# EAGLE design USB-RS232 Adapter (EAGLE 4.16)
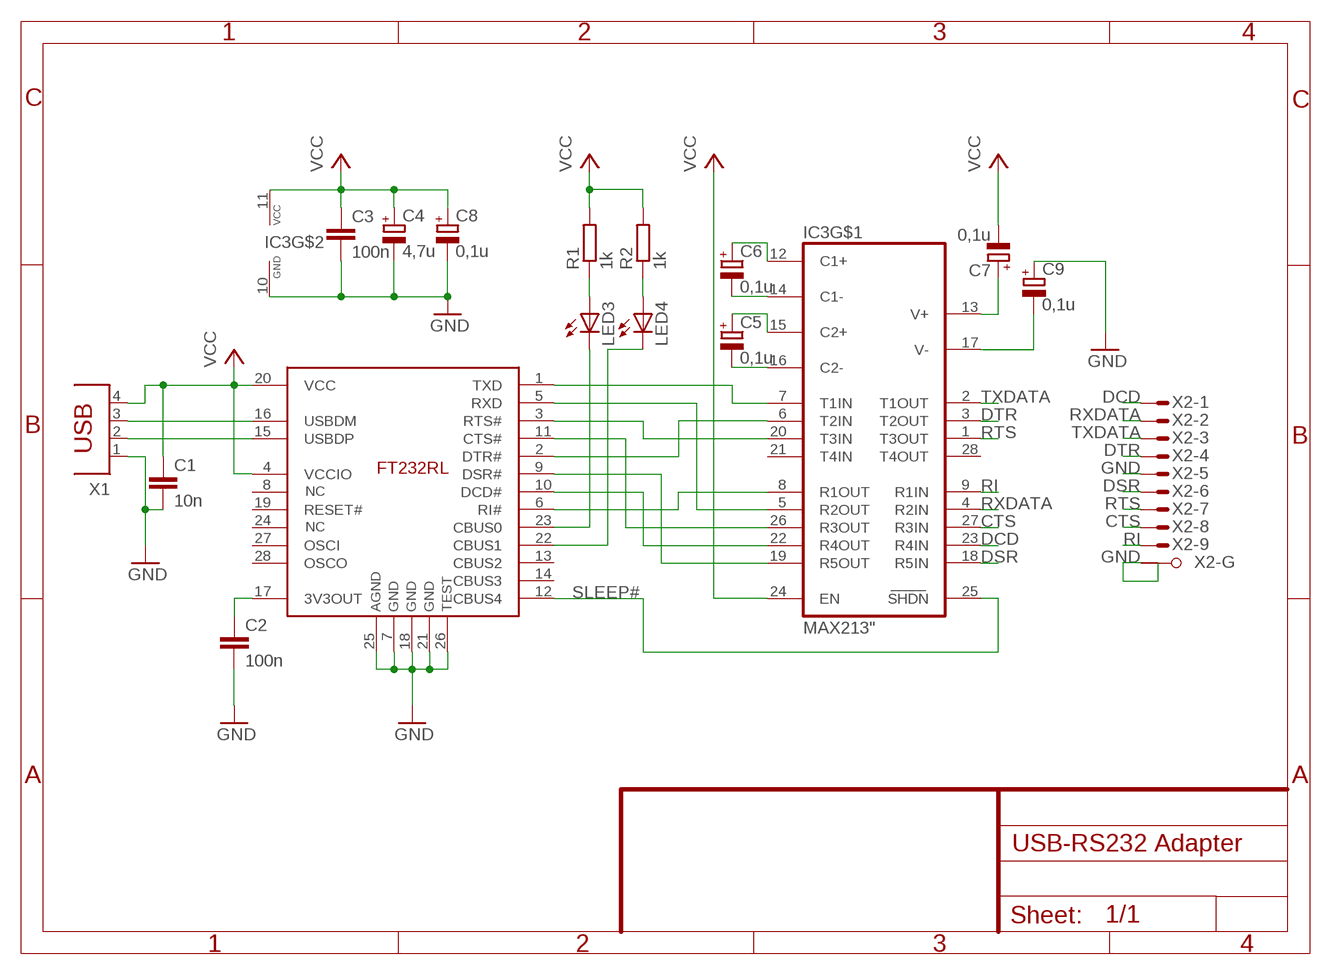
[diagram p0: schematic, sheet 1]

## Parts
C1  10n  C-EUC1206  [C1206]
C2  100n  C-EUC1206  [C1206]
C3  100n  C-EUC1206  [C1206]
C4  4,7u  CPOL-EUSMCD  [SMC_D]
C5  0,1u  CPOL-EUSMCA  [SMC_A]
C6  0,1u  CPOL-EUSMCA  [SMC_A]
C7  0,1u  CPOL-EUSMCA  [SMC_A]
C8  0,1u  CPOL-EUSMCA  [SMC_A]
C9  0,1u  CPOL-EUSMCA  [SMC_A]
IC1  FT232R  [SSOP28]
IC3  MAX213"  [SSOP28]
LED3  LEDCHIPLED_1206  [CHIPLED_1206]
LED4  LEDCHIPLED_1206  [CHIPLED_1206]
R1  1k  R-EU_M1206  [M1206]
R2  1k  R-EU_M1206  [M1206]
X1  PN87520  [PN87520]
X2  M09HPS  [M09HP]

## Nets
CTS: IC3.27(R3IN) X2.8(-8:M)
CTS#: IC1.11(CTS#) IC3.26(R3OUT)
DCD: IC3.23(R4IN) X2.1(-1:M)
DCD#: IC1.10(DCD#) IC3.22(R4OUT)
DSR: IC3.18(R5IN) X2.6(-6:M)
DSR#: IC1.9(DSR#) IC3.19(R5OUT)
DTR: IC3.3(T2OUT) X2.4(-4:M)
DTR#: IC1.2(DTR#) IC3.6(T2IN)
GND: C1.2 C2.2 C3.2 C4.- C8.- C9.+ IC1.7(GND1) IC1.18(GND2) IC1.21(GND3) IC1.25(AGND) IC1.26(TEST) IC3.10(GND) X1.1 X2.5(-5:M) X2.G1(-G:G1) X2.G2(-G:G2)
N$1: C2.1 IC1.17(3V3OUT)
N$2: IC1.16(USBDM) X1.3
N$3: IC1.15(USBDP) X1.2
N$4: C5.- IC3.16(C2-)
N$5: C5.+ IC3.15(C2+)
N$6: C6.- IC3.14(C1-)
N$7: C6.+ IC3.12(C1+)
N$10: C9.- IC3.17(V-)
N$12: C7.+ IC3.13(V+)
N$15: LED3.A R1.1
N$16: LED4.A R2.1
RI: IC3.9(R1IN) X2.9(-9:M)
RI#: IC1.6(RI#) IC3.8(R1OUT)
RTS: IC3.1(T3OUT) X2.7(-7:M)
RTS#: IC1.3(RTS#) IC3.20(T3IN)
RXD: IC1.5(RXD) IC3.5(R2OUT)
RXDATA: IC3.4(R2IN) X2.2(-2:M)
RXDLED: IC1.22(CBUS1) LED4.C
SLEEP#: IC1.12(CBUS4) IC3.25(SHDN)
TXD: IC1.1(TXD) IC3.7(T1IN)
TXDATA: IC3.2(T1OUT) X2.3(-3:M)
TXDLED: IC1.23(CBUS0) LED3.C
VCC: C1.1 C3.1 C4.+ C7.- C8.+ IC1.4(VCCIO) IC1.20(VCC) IC3.11(VCC) IC3.24(EN) R1.2 R2.2 X1.4
Unconnected: IC1.8(NC1) IC1.13(CBUS2) IC1.14(CBUS3) IC1.19(RESET#) IC1.24(NC2) IC1.27(OSCI) IC1.28(OSCO) IC3.21(T4IN) IC3.28(T4OUT)

## Library data of the parts
C1-C3 = rcl:C-EU: CAPACITOR, European symbol
C4-C9 = rcl:CPOL-EU: POLARIZED CAPACITOR, European symbol
IC1 = ftdichip:FT232R: FT232RL der Firma FTDIchip.com USB Seriell Converter. Ideal um einen RS232 Anschluss für den Laptop bereitzustellen. unter www.wsgs.net gibt es auch ein Eagle Board dazu.
IC3 = maxim:MAX213*
LED3 LED4 = led:LED: LED OSRAM: - CHIPLED LG R971, LG N971, LY N971, LG Q971, LY Q971, LO R971, LY R971 LH N974, LH R974 LS Q976, LO Q976, LY Q976 LO Q996 - Hyper CHIPLED LW Q18S LB Q993, LB Q99A, LB R99A - SideLED LS A670, LO A670, LY A670, LG A670, LP A670 LB A673, LV A673, LT A673, LW A673 LH A674 LY A675 LS A676, LA A676, LO A676, LY A676, LW A676 LS A679, LY A679, LG A679 - Hyper Micro SIDELED® LS Y876, LA Y876, LO Y876, LY Y876 LT Y87S - SmartLED LW L88C, LW L88S LB L89C, LB L89S, LG L890 LS L89K, LO L89K, LY L89K LS L896, LA L896, LO L896, LY L896 - TOPLED LS T670, LO T670, LY T670, LG T670, LP T670 LSG T670, LSP T670, LSY T670, LOP T670, LYG T670 LG T671, LOG T671, LSG T671 LB T673, LV T673, LT T673, LW T673 LH T674 LS T676, LA T676, LO T676, LY T676, LB T676, LH T676, LSB T676, LW T676 LB T67C, LV T67C, LT T67C, LS T67K, LO T67K, LY T67K, LW E67C LS E67B, LA E67B, LO E67B, LY E67B, LB E67C, LV E67C, LT E67C LW T67C LS T679, LY T679, LG T679 LS T770, LO T770, LY T770, LG T770, LP T770 LB T773, LV T773, LT T773, LW T773 LH T774 LS E675, LA E675, LY E675, LS T675 LS T776, LA T776, LO T776, LY T776, LB T776 LHGB T686 LT T68C, LB T68C - Hyper Mini TOPLED® LB M676 - Mini TOPLED Santana® LG M470 LS M47K, LO M47K, LY M47K Source: http://www.osram.convergy.de/
R1 R2 = rcl:R-EU_: RESISTOR, European symbol
X1 = con-berg:PN87520: BERG USB connector
X2 = con-subd:M09HPS: SUB-D

## Board
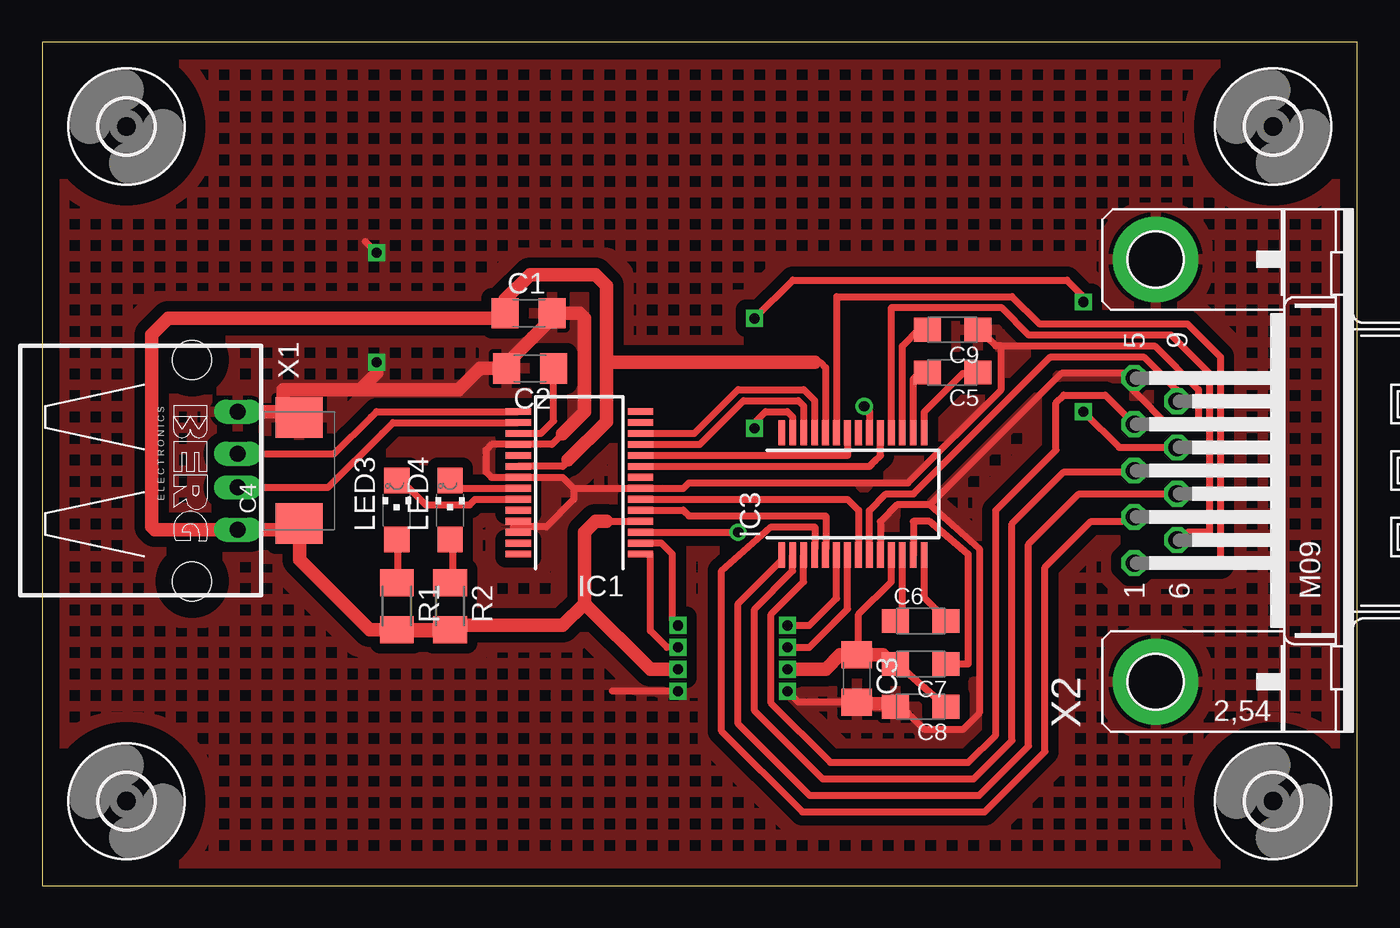
[diagram p1: board, top side]
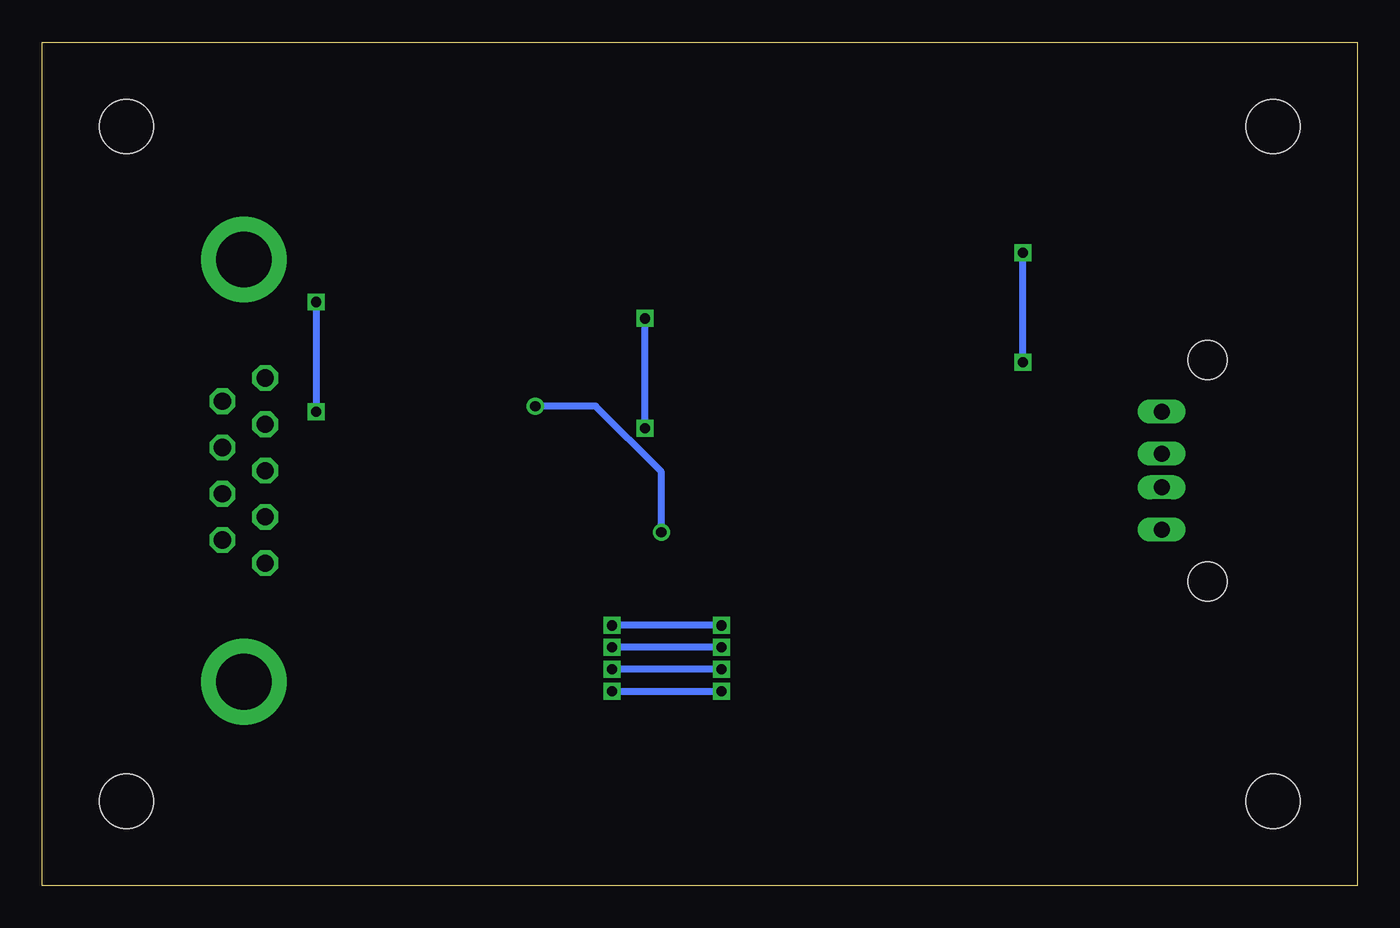
[diagram p2: board, bottom side, seen from below]

Size 78 x 50 mm. Coordinates in mm from the lower left corner, seen from the top.
Outline: 0,50 0,0 78,0 78,50 0,50
Copper layers (1*16): Top 0.035mm / dielectric 1.5mm / Bottom 0.035mm
Design rules "default": minimum track width 16mil, minimum drill 24mil, track to track 8mil, track to pad 8mil, pad to pad 8mil, via to via 8mil, smd to smd 8mil, copper to edge 40mil, drill to drill 8mil, minimum pad ring 8mil, minimum via ring 8mil, stop-mask expansion 4mil, vias tented up to drill 0mil, thermal gap 10mil

### Footprints (pad centres in the part's own frame; a part is rotated, then mirrored left to right if it is on the bottom)
C1206 = smd 1.6 x 1.8: 1 -1.4,0; 2 1.4,0
SMC_D = smd 2.4 x 2.8: + -3.15,0; - 3.15,0
SMC_A = smd 1.6 x 1.4: + -1.5,0; - 1.5,0
SSOP28 = smd 0.4 x 1.5: 1 -4.225,-3.625; 2 -3.575,-3.625; 3 -2.925,-3.625; 4 -2.275,-3.625; 5 -1.625,-3.625; 6 -0.975,-3.625; 7 -0.325,-3.625; 8 0.325,-3.625; 9 0.975,-3.625; 10 1.625,-3.625; 11 2.275,-3.625; 12 2.925,-3.625; 13 3.575,-3.625; 14 4.225,-3.625; 15 4.225,3.625; 16 3.575,3.625; 17 2.925,3.625; 18 2.275,3.625; 19 1.625,3.625; 20 0.975,3.625; 21 0.325,3.625; 22 -0.325,3.625; 23 -0.975,3.625; 24 -1.625,3.625; 25 -2.275,3.625; 26 -2.925,3.625; 27 -3.575,3.625; 28 -4.225,3.625
CHIPLED_1206 = smd 1.5 x 1.5: A 0,-1.75; C 0,1.75
M1206 = smd 1.6 x 2: 1 -1.4,0; 2 1.4,0
3,2 = hole 3.2: 0,0
PN87520 = drill 0.95 long: 1 -3.5,2.71; 2 -1,2.71; 3 1,2.71; 4 3.5,2.71 | hole 2.3: -6.57,0; 6.57,0
M09HP = drill 1.016 octagon: 1 -5.486,1.27; 2 -2.743,1.27; 3 0,1.27; 4 2.743,1.27; 5 5.486,1.27; 6 -4.115,-1.27; 7 -1.372,-1.27; 8 1.372,-1.27; 9 4.115,-1.27 | drill 3.302 pad 5.08 round: G1 -12.522,0; G2 12.522,0

### Placement (x,y rotation side)
C1  28.85,33.93 0 top
C2  28.93,30.66 180 top
C3  48.31,12.27 270 top
C4  15.24,24.6 90 top
C5  53.99,30.41 180 top
C6  52.1,15.68 0 top
C7  52.1,13.14 180 top
C8  52.1,10.6 180 top
C9  53.99,32.95 180 top
IC1  31.86,23.88 90 top
IC3  48.09,23.21 0 top
LED3  21.03,22.26 0 top
LED4  24.19,22.26 0 top
R1  21.03,16.56 270 top
R2  24.19,16.56 270 top
U$1  [3,2]  5,45 270 top
U$2  [3,2]  5,5 270 top
U$3  [3,2]  73,45 270 top
U$4  [3,2]  73,5 270 top
X1  8.89,24.6 270 top
X2  66.04,24.6 90 top

### Tracks (layer width: path | path; a pad name or v marks a point on that pad's centre or on a via)
CTS  (via drill 0.6)
  Top 0.406: X2.8 63.87,25.97 v61.75,28.09 | v61.75,34.59 61.75,34.92 60.77,35.89 44.52,35.89 v42.25,33.62 | IC3.27 44.51,27.78 44.2,28.09 42.9,28.09 42.25,27.45 v42.25,27.12
  Bottom 0.406: v61.75,34.59 v61.75,28.09 | v42.25,27.12 v42.25,33.62
CTS#
  Top 0.406: 44.85,28.74 41.6,28.74 39.01,26.15 IC1.11 | 44.85,28.74 45.17,28.42 | IC3.26 45.16,28.43 44.85,28.74
DCD
  Top 0.406: IC3.23 47.12,27.45 47.12,34.92 57.52,34.92 59.15,33.3 67.92,33.3 69.88,31.34 69.88,18.99 65.33,18.99 X2.1
DCD#
  Top 0.406: IC3.22 47.77,26.14 47.77,25.49 47.77,25.5 IC1.10
DSR
  Top 0.406: IC3.18 50.38,27.45 50.38,34.27 56.88,34.27 58.5,32.64 66.95,32.64 69.22,30.37 69.22,20.95 67.92,20.95 X2.6
DSR#
  Top 0.406: 49.71,25.48 IC3.19 | 49.71,25.48 49.73,25.49 | 49.4,25.17 49.71,25.48 | 49.4,25.17 49.08,24.84 | IC1.9 49.08,24.85 49.4,25.17
DTR
  Top 0.406: X2.4 63.05,29.07 60.59,29.07 60.12,28.61 60.12,25.82 56.55,22.24 56.55,8.92 54.92,7.29 46.74,7.29 43.23,10.81 43.23,16.07 45.16,18.01 IC3.3
DTR#  (via drill 0.6)
  Top 0.406: 37.05,19.97 37.38,19.64 37.38,15.75 v37.7,15.42 | 37.05,19.97 36.73,20.29 | IC1.2 36.72,20.3 37.05,19.97 | v44.2,15.42 45.5,15.42 47.11,17.03 IC3.6
  Bottom 0.406: v37.7,15.42 v44.2,15.42
GND  (via drill 0.6)
  Top 0.406: C4.- 13.97,27.77 | 52.65,22.57 55.58,19.97 55.58,10.22 54.6,9.25 52.33,9.25 51.35,10.22 C8.- | 56.88,31.99 65.97,31.99 68.58,29.39 68.58,27.45 66.62,27.45 65,29.07 | 56.88,31.99 56.55,31.99 56.23,32.32 C9.+ | 65,29.07 64.67,29.39 | 56.88,31.99 56.88,29.39 51.35,23.87 38.35,23.87 | 38.35,23.87 38.02,23.54 | 52.65,22.57 60.45,30.37 64.35,30.37 64.63,30.09 X2.5 64.77,29.3 65,29.07 | v19.82,37.52 19.18,38.17 | 48.1,10.87 44.85,10.87 v44.2,11.52 | v37.7,11.52 33.8,11.52 | 38.35,23.87 38.03,23.55 IC1.7 32.17,23.55 32.17,23.54 31.52,23.54 | 31.52,23.54 30.87,24.2 IC1.21 26.64,24.2 26.32,24.52 26.32,25.82 26.66,26.15 IC1.18 30.23,26.15 30.55,26.47 | 31.52,23.54 31.52,22.89 29.9,21.27 28.27,21.27 | 28.27,21.27 27.95,21.27 | 28.27,21.27 28.27,20.95 IC1.26 | 28.27,21.27 28.27,21.59 IC1.25 | 30.55,26.47 30.23,26.14 | 30.88,26.79 30.55,26.47 | IC3.10 49.71,21.58 50.7,22.57 52.65,22.57
  Top 0.813: 50.6,10.77 50.7,10.87 | C8.- 50.6,10.77 | X1.1 14.62,28.1 14.95,27.77 | 18.85,29.39 14.3,29.39 14.3,28.42 14.95,27.77 | 18.85,29.39 24.7,29.39 25.96,30.66 C2.2 27.53,30.92 30.54,33.93 | 14.95,27.77 14.97,27.75 C4.- | v19.82,31.02 19.82,30.37 18.85,29.39 | 30.54,33.93 31.86,33.93 32.17,33.62 32.17,28.09 30.88,26.79 | 30.54,33.93 30.55,33.95 | 30.54,33.93 C1.2 | C3.2 48.1,10.87 48.2,10.77 50.6,10.77
  Bottom 0.406: v19.82,31.02 v19.82,37.52 | v44.2,11.52 v37.7,11.52
  pour Top (isolate 0.61, hatched): -1.3,51.17 -1.3,-0.83 79.3,-0.83 79.3,51.17
N$1
  Top 0.406: C2.1 30.33,27.55 29.58,26.8 IC1.17
N$2
  Top 0.406: 20.15,26.79 20.8,27.45 | IC1.16 20.8,27.45 20.15,26.79 | X1.3 16.95,23.6 20.15,26.79
N$3
  Top 0.406: 19.5,27.77 19.82,28.09 | IC1.15 19.83,28.1 19.5,27.77 | X1.2 17.33,25.6 19.5,27.77
N$4
  Top 0.406: C5.- 52.04,30.41 51.66,30.03 IC3.16
N$5
  Top 0.406: IC3.15 52.31,28.08 54.6,30.37 55.58,30.37 55.53,30.41 C5.+
N$6
  Top 0.406: C6.- 53.6,15.72 53.62,15.75 52.31,17.06 IC3.14
N$7
  Top 0.406: 51.02,16.07 C6.+ 50.6,15.52 50.7,15.42 51.01,15.73 IC3.12
N$10
  Top 0.406: C9.- 52.02,32.95 52,32.97 51.01,31.98 IC3.17
N$12
  Top 0.406: C7.+ 54.27,13.15 54.92,13.15 54.92,19.64 52.65,21.59 51.67,21.59 51.66,21.58 IC3.13
N$15
  Top 0.406: LED3.A 21.12,19.97 21.12,18.67 R1.1
N$16
  Top 0.406: LED4.A 24.38,19.97 24.38,18.67 R2.1
RI
  Top 0.406: X2.9 67.28,29.39 65.33,31.34 59.8,31.34 51.67,23.22 50.05,23.22 49.06,22.23 IC3.9
RI#
  Top 0.406: IC1.6 47.77,22.9 48.41,22.26 IC3.8
RTS
  Top 0.406: X2.7 66.62,23.22 61.49,23.22 58.5,20.23 58.5,8.27 55.58,5.34 45.51,5.34 41.27,9.58 41.27,16.72 43.86,19.31 IC3.1
RTS#  (via drill 0.61)
  Top 0.406: v48.75,28.42 49.08,28.09 49.08,27.45 IC3.20 | IC1.3 v41.27,20.95
  Bottom 0.406: v41.27,20.95 41.27,24.52 45.17,28.42 v48.75,28.42
RXD
  Top 0.406: 38.35,21.92 46.48,21.92 46.48,20.29 IC3.5 | 38.35,21.92 38.02,22.24 | IC1.5 38.02,22.25 38.35,21.92
RXDATA
  Top 0.406: IC3.4 45.83,20.29 45.83,21.27 43.23,21.27 40.3,18.67 40.3,9.16 45.09,4.37 55.9,4.37 59.48,7.94 59.48,18.87 62.2,21.59 64.03,21.59 X2.2
RXDLED
  Top 0.406: 24.7,23.54 LED4.C 24.05,23.87 24.37,23.55 IC1.22
SLEEP#
  Top 0.406: IC3.25 45.81,28.73 45.83,28.74 45.17,29.39 41.27,29.39 38.68,26.8 IC1.12
TXD  (via drill 0.6)
  Top 0.406: IC1.1 36.08,19.64 36.08,15.1 37.05,14.12 v37.7,14.12 | v44.2,14.12 45.5,14.12 47.76,16.38 IC3.7
  Bottom 0.406: v37.7,14.12 v44.2,14.12
TXDATA
  Top 0.406: X2.3 64.03,24.52 60.61,24.52 57.52,21.44 57.52,8.6 55.25,6.32 46.28,6.32 42.25,10.35 42.25,16.39 44.51,18.66 IC3.2
TXDLED
  Top 0.406: 25.35,22.57 25.68,22.89 | LED3.C 21.77,23.54 22.75,22.57 25.35,22.57 | IC1.23 25.68,22.9 25.35,22.57
VCC  (via drill 0.6)
  Top 0.406: C3.1 48.42,13.79 48.42,16.07 50.36,18.01 IC3.11 | C4.+ 13.97,21.27 | 21.77,15.1 R1.2 | R2.2 23.4,15.1 | 26.98,33.62 C1.1 | 37.38,12.82 37.05,12.82 | C7.- 50.7,13.15 C8.+ | 45.83,31.02 46.15,31.02 46.46,30.71 IC3.24 | 31.2,25.23 31.2,25.17 30.88,24.85 IC1.20 | 33.48,21.6 IC1.4
  Top 0.813: 23.4,15.1 21.77,15.1 | 26.98,33.62 7.47,33.62 6.5,32.64 6.5,21.27 6.67,21.1 X1.4 14.78,21.1 15.13,21.45 C4.+ 15.24,21.3 15.28,21.27 15.28,19.32 19.43,15.16 R2.2 24.19,15.28 24.05,15.42 26.65,15.42 | 26.65,15.42 27.62,15.42 | 32.17,16.72 36.08,12.82 37.38,12.82 v37.7,12.82 | 32.17,16.72 30.88,15.42 26.65,15.42 | v44.2,12.82 46.48,12.82 47.33,13.67 C3.1 49.85,13.67 50.38,13.14 C7.- | C1.1 27.45,34.74 28.93,36.22 32.83,36.22 33.48,35.57 33.48,31.02 | 33.48,31.02 45.83,31.02 | 31.2,25.23 33.48,27.51 33.48,31.02 | 32.17,16.72 32.17,20.95 32.83,21.59 33.48,21.59 33.48,21.6
  Bottom 0.406: v37.7,12.82 v44.2,12.82